# EAGLE schematic RAM Board Deux (EAGLE 6.6.0)
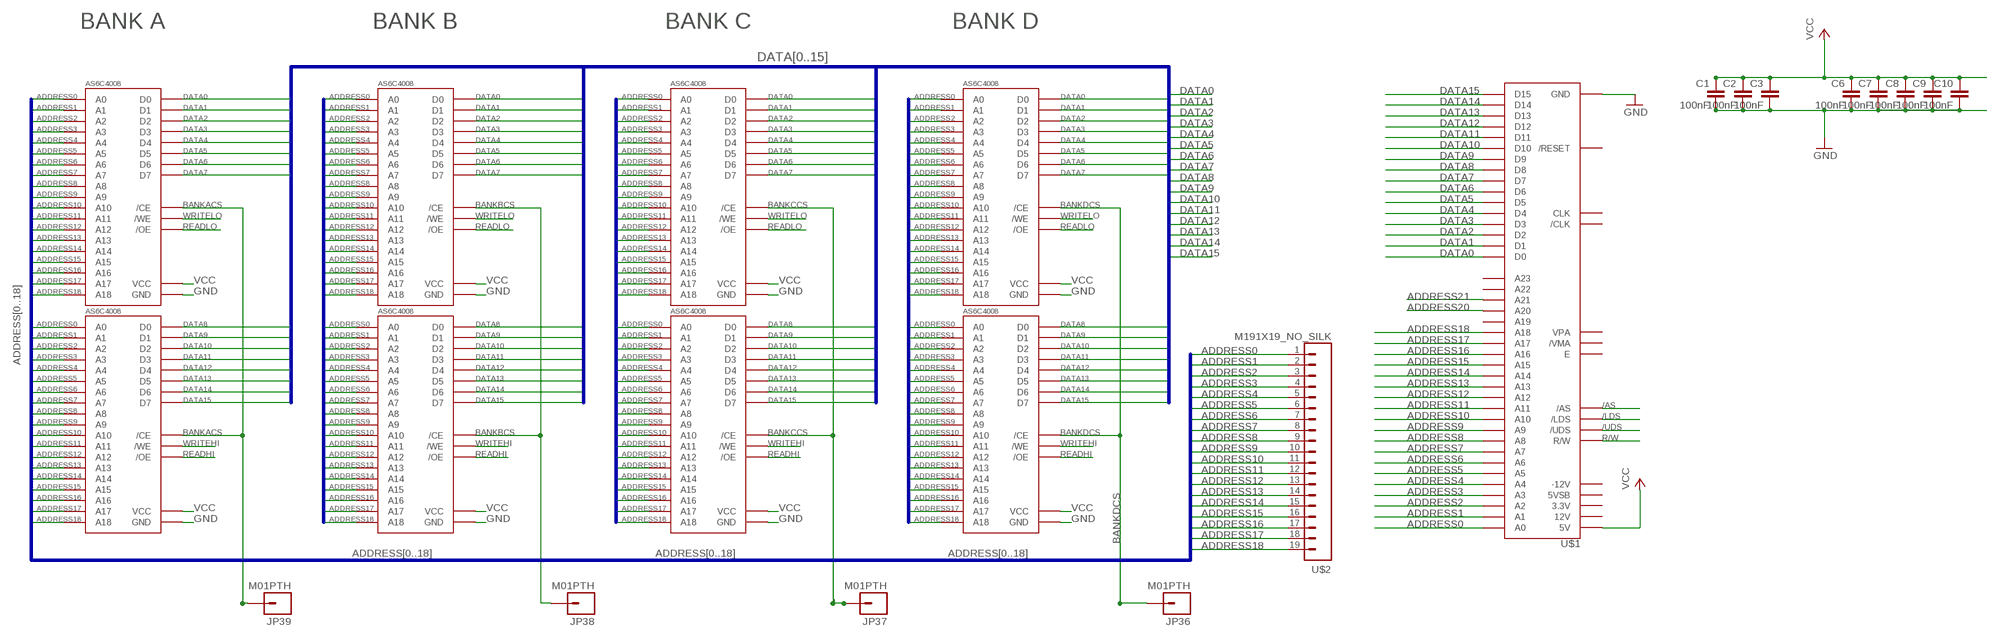
[diagram p0: schematic, sheet 1]

## Parts
C1  100nF  CAPPTH  [CAP-PTH-SMALL]
C2  100nF  CAPPTH  [CAP-PTH-SMALL]
C3  100nF  CAPPTH  [CAP-PTH-SMALL]
C6  100nF  CAPPTH  [CAP-PTH-SMALL]
C7  100nF  CAPPTH  [CAP-PTH-SMALL]
C8  100nF  CAPPTH  [CAP-PTH-SMALL]
C9  100nF  CAPPTH  [CAP-PTH-SMALL]
C10  100nF  CAPPTH  [CAP-PTH-SMALL]
JP36  M01PTH  [1X01]
JP37  M01PTH  [1X01]
JP38  M01PTH  [1X01]
JP39  M01PTH  [1X01]
U1  AS6C4008  [DIL32]
U2  AS6C4008  [DIL32]
U3  AS6C4008  [DIL32]
U4  AS6C4008  [DIL32]
U5  AS6C4008  [DIL32]
U6  AS6C4008  [DIL32]
U7  AS6C4008  [DIL32]
U8  AS6C4008  [DIL32]
U$1  BLANKBOARD  [BLANKBOARD]
U$2  M191X19_NO_SILK  [1X19_NO_SILK]

## Nets
/AS: U$1./AS
/LDS: U$1./LDS
/UDS: U$1./UDS
ADDRESS0: U1.12(A0) U2.12(A0) U3.12(A0) U4.12(A0) U5.12(A0) U6.12(A0) U7.12(A0) U8.12(A0) U$1.A0 U$2.1
ADDRESS1: U1.11(A1) U2.11(A1) U3.11(A1) U4.11(A1) U5.11(A1) U6.11(A1) U7.11(A1) U8.11(A1) U$1.A1 U$2.2
ADDRESS2: U1.10(A2) U2.10(A2) U3.10(A2) U4.10(A2) U5.10(A2) U6.10(A2) U7.10(A2) U8.10(A2) U$1.A2 U$2.3
ADDRESS3: U1.9(A3) U2.9(A3) U3.9(A3) U4.9(A3) U5.9(A3) U6.9(A3) U7.9(A3) U8.9(A3) U$1.A3 U$2.4
ADDRESS4: U1.8(A4) U2.8(A4) U3.8(A4) U4.8(A4) U5.8(A4) U6.8(A4) U7.8(A4) U8.8(A4) U$1.A4 U$2.5
ADDRESS5: U1.7(A5) U2.7(A5) U3.7(A5) U4.7(A5) U5.7(A5) U6.7(A5) U7.7(A5) U8.7(A5) U$1.A5 U$2.6
ADDRESS6: U1.6(A6) U2.6(A6) U3.6(A6) U4.6(A6) U5.6(A6) U6.6(A6) U7.6(A6) U8.6(A6) U$1.A6 U$2.7
ADDRESS7: U1.5(A7) U2.5(A7) U3.5(A7) U4.5(A7) U5.5(A7) U6.5(A7) U7.5(A7) U8.5(A7) U$1.A7 U$2.8
ADDRESS8: U1.27(A8) U2.27(A8) U3.27(A8) U4.27(A8) U5.27(A8) U6.27(A8) U7.27(A8) U8.27(A8) U$1.A8 U$2.9
ADDRESS9: U1.26(A9) U2.26(A9) U3.26(A9) U4.26(A9) U5.26(A9) U6.26(A9) U7.26(A9) U8.26(A9) U$1.A9 U$2.10
ADDRESS10: U1.23(A10) U2.23(A10) U3.23(A10) U4.23(A10) U5.23(A10) U6.23(A10) U7.23(A10) U8.23(A10) U$1.A10 U$2.11
ADDRESS11: U1.25(A11) U2.25(A11) U3.25(A11) U4.25(A11) U5.25(A11) U6.25(A11) U7.25(A11) U8.25(A11) U$1.A11 U$2.12
ADDRESS12: U1.4(A12) U2.4(A12) U3.4(A12) U4.4(A12) U5.4(A12) U6.4(A12) U7.4(A12) U8.4(A12) U$1.A12 U$2.13
ADDRESS13: U1.28(A13) U2.28(A13) U3.28(A13) U4.28(A13) U5.28(A13) U6.28(A13) U7.28(A13) U8.28(A13) U$1.A13 U$2.14
ADDRESS14: U1.3(A14) U2.3(A14) U3.3(A14) U4.3(A14) U5.3(A14) U6.3(A14) U7.3(A14) U8.3(A14) U$1.A14 U$2.15
ADDRESS15: U1.31(A15) U2.31(A15) U3.31(A15) U4.31(A15) U5.31(A15) U6.31(A15) U7.31(A15) U8.31(A15) U$1.A15 U$2.16
ADDRESS16: U1.2(A16) U2.2(A16) U3.2(A16) U4.2(A16) U5.2(A16) U6.2(A16) U7.2(A16) U8.2(A16) U$1.A16 U$2.17
ADDRESS17: U1.30(A17) U2.30(A17) U3.30(A17) U4.30(A17) U5.30(A17) U6.30(A17) U7.30(A17) U8.30(A17) U$1.A17 U$2.18
ADDRESS18: U1.1(A18) U2.1(A18) U3.1(A18) U4.1(A18) U5.1(A18) U6.1(A18) U7.1(A18) U8.1(A18) U$1.A18 U$2.19
ADDRESS20: U$1.A20
ADDRESS21: U$1.A21
BANKACS: JP39.1 U1.22(/CE) U2.22(/CE)
BANKBCS: JP38.1 U3.22(/CE) U4.22(/CE)
BANKCCS: JP37.1 U5.22(/CE) U6.22(/CE)
BANKDCS: JP36.1 U7.22(/CE) U8.22(/CE)
DATA0: U2.13(D0) U4.13(D0) U6.13(D0) U8.13(D0) U$1.D0
DATA1: U2.14(D1) U4.14(D1) U6.14(D1) U8.14(D1) U$1.D1
DATA2: U2.15(D2) U4.15(D2) U6.15(D2) U8.15(D2) U$1.D2
DATA3: U2.17(D3) U4.17(D3) U6.17(D3) U8.17(D3) U$1.D3
DATA4: U2.18(D4) U4.18(D4) U6.18(D4) U8.18(D4) U$1.D4
DATA5: U2.19(D5) U4.19(D5) U6.19(D5) U8.19(D5) U$1.D5
DATA6: U2.20(D6) U4.20(D6) U6.20(D6) U8.20(D6) U$1.D6
DATA7: U2.21(D7) U4.21(D7) U6.21(D7) U8.21(D7) U$1.D7
DATA8: U1.13(D0) U3.13(D0) U5.13(D0) U7.13(D0) U$1.D8
DATA9: U1.14(D1) U3.14(D1) U5.14(D1) U7.14(D1) U$1.D9
DATA10: U1.15(D2) U3.15(D2) U5.15(D2) U7.15(D2) U$1.D10
DATA11: U1.17(D3) U3.17(D3) U5.17(D3) U7.17(D3) U$1.D11
DATA12: U1.18(D4) U3.18(D4) U5.18(D4) U7.18(D4) U$1.D12
DATA13: U1.19(D5) U3.19(D5) U5.19(D5) U7.19(D5) U$1.D13
DATA14: U1.20(D6) U3.20(D6) U5.20(D6) U7.20(D6) U$1.D14
DATA15: U1.21(D7) U3.21(D7) U5.21(D7) U7.21(D7) U$1.D15
GND: C1.2 C2.2 C3.2 C6.2 C7.2 C8.2 C9.2 C10.2 U1.16(GND) U2.16(GND) U3.16(GND) U4.16(GND) U5.16(GND) U6.16(GND) U7.16(GND) U8.16(GND) U$1.GND
R/W: U$1.R/W
READHI: U1.24(/OE) U3.24(/OE) U5.24(/OE) U7.24(/OE)
READLO: U2.24(/OE) U4.24(/OE) U6.24(/OE) U8.24(/OE)
VCC: C1.1 C2.1 C3.1 C6.1 C7.1 C8.1 C9.1 C10.1 U1.32(VCC) U2.32(VCC) U3.32(VCC) U4.32(VCC) U5.32(VCC) U6.32(VCC) U7.32(VCC) U8.32(VCC) U$1.5V
WRITEHI: U1.29(/WE) U3.29(/WE) U5.29(/WE) U7.29(/WE)
WRITELO: U2.29(/WE) U4.29(/WE) U6.29(/WE) U8.29(/WE)
Unconnected: U$1.3V3(3.3V) U$1.5VSB U$1.12V U$1.-12V U$1./CLK U$1./RESET U$1./VMA U$1.A19 U$1.A22 U$1.A23 U$1.CLK U$1.E U$1.VPA

## Buses
ADDRESS[0..18]
DATA[0..15]

## Notes on the sheet
- BANK A | BANK B | BANK C | BANK D

## Library data of the parts
C1-C3 C6-C10 = SparkFun-Capacitors:CAP: Capacitor Standard 0603 ceramic capacitor, and 0.1" leaded capacitor.
JP36-JP39 = SparkFun-Connectors:M01: Header 1 Standard 1-pin 0.1" header. Use with straight break away headers (SKU : PRT-00116), right angle break away headers (PRT-00553), swiss pins (PRT-00743), machine pins (PRT-00117), and female headers (PRT-00115).
U1-U8 = Benchoff:AS6C4008
U$1 = Benchoff:BLANKBOARD
U$2 = SparkFun-Connectors:M19: 1x19 .1" header